# EAGLE design hid_detector (EAGLE 9.6.2)
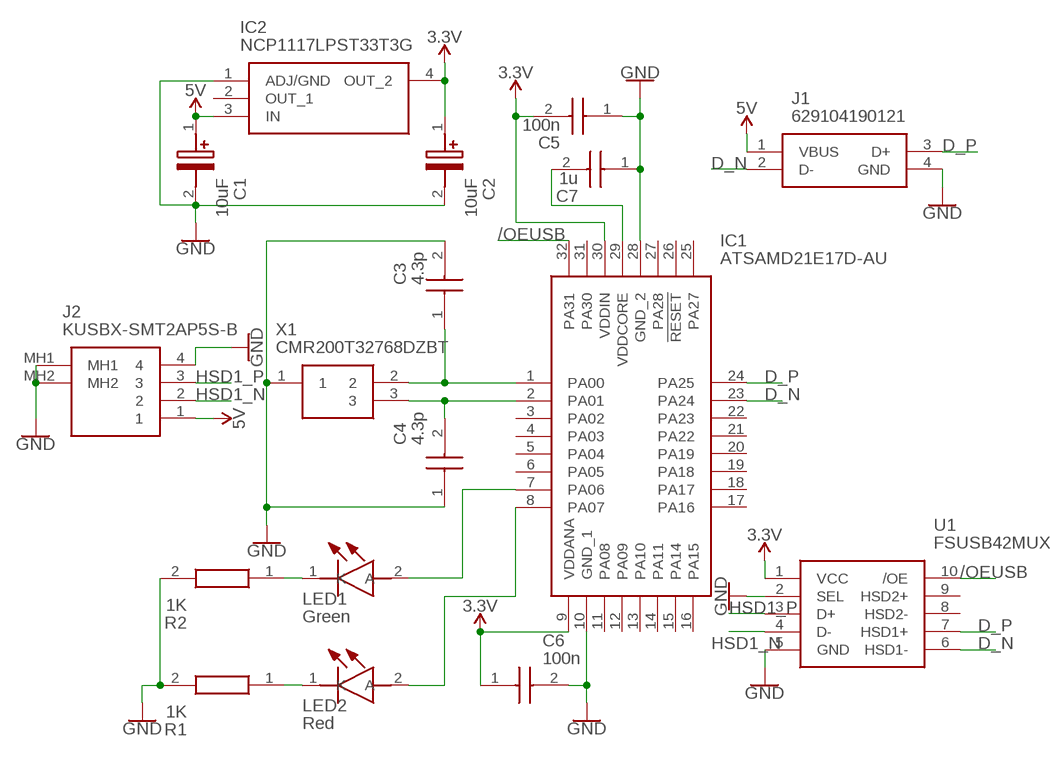
[diagram p0: schematic, sheet 1]

## Parts
C1  10uF  865080440002  [CAPAE400X550N]
C2  10uF  865080440002  [CAPAE400X550N]
C3  4.3p  GRM0335C1E4R3WA01D  [CAPC0603X33N]
C4  4.3p  GRM0335C1E4R3WA01D  [CAPC0603X33N]
C5  100n  EMF105B7104MVHF  [CAPC1005X55N]
C6  100n  EMF105B7104MVHF  [CAPC1005X55N]
C7  1u  EMK105BJ105MVHF  [CAPC1005X55N]
IC1  ATSAMD21E17D-AU  [QFP80P900X900X120-32N]
IC2  NCP1117LPST33T3G  [SOT230P700X180-4N]
J1  629104190121  [629104190121]
J2  KUSBX-SMT2AP5S-B  [KUSBXSMT2AP5SB]
LED1  Green  CMD15-21VGD_TR8  [LEDC3215X130N]
LED2  Red  APT1608EC  [LEDC1608X85N]
R1  1K  RK73H1ETTP1001F  [RESC1005X40N]
R2  1K  RK73H1ETTP1001F  [RESC1005X40N]
U1  FSUSB42MUX  [SOP50P490X110-10N]
X1  CMR200T32768DZBT  [CMR200T]

## Nets
3.3V: C2.1(+) C5.2 C6.1 IC1.9(VDDANA) IC1.30(VDDIN) IC2.4(OUT_2) U1.1(VCC)
5V: C1.1(+) IC2.3(IN) J1.1(VBUS) J2.1
/OEUSB: IC1.32(PA31) U1.10(/OE)
D_N [diff pairs]: IC1.23(PA24) J1.2(D-) U1.6(HSD1-)
D_P [diff pairs]: IC1.24(PA25) J1.3(D+) U1.7(HSD1+)
GND: C1.2(-) C2.2(-) C3.2 C4.1 C5.1 C6.2 C7.1 IC1.10(GND_1) IC1.28(GND_2) IC2.1(ADJ/GND) J1.4(GND) J2.4 J2.MH1 J2.MH2 R1.2 R2.2 U1.2(SEL) U1.5(GND) X1.1
HSD1_N [diff pairs]: J2.2 U1.4(D-)
HSD1_P [diff pairs]: J2.3 U1.3(D+)
N$1: C3.1 IC1.1(PA00) X1.2
N$2: C4.2 IC1.2(PA01) X1.3
N$3: IC1.7(PA06) LED1.2(A)
N$4: LED1.1(K) R2.1
N$5: C7.2 IC1.29(VDDCORE)
N$6: LED2.1(K) R1.1
N$7: IC1.8(PA07) LED2.2(A)
Unconnected: IC1.3(PA02) IC1.4(PA03) IC1.5(PA04) IC1.6(PA05) IC1.11(PA08) IC1.12(PA09) IC1.13(PA10) IC1.14(PA11) IC1.15(PA14) IC1.16(PA15) IC1.17(PA16) IC1.18(PA17) IC1.19(PA18) IC1.20(PA19) IC1.21(PA22) IC1.22(PA23) IC1.25(PA27) IC1.26(!RESET) IC1.27(PA28) IC1.31(PA30) IC2.2(OUT_1) U1.8(HSD2-) U1.9(HSD2+)

## Library data of the parts
C1 C2 = SamacSys_Parts:865080440002: Wurth Elektronik 10uF 25 V dc Aluminium Electrolytic Capacitor, WCAP-ASLI Series 2000h 4 (Dia.) x 5.35mm Source: Datasheet <https://katalog.we-online.com/pbs/datasheet/865080440002.pdf>; DESCRIPTION: Wurth Elektronik 10uF 25 V dc Aluminium Electrolytic Capacitor, WCAP-ASLI Series 2000h 4 (Dia.) x 5.35mm; HEIGHT: 5.5mm; MANUFACTURER_NAME: Wurth Elektronik; MANUFACTURER_PART_NUMBER: 865080440002; MOUSER_PART_NUMBER: 710-865080440002; MOUSER_PRICE-STOCK: https://www.mouser.co.uk/ProductDetail/Wurth-Elektronik/865080440002?qs=0KOYDY2FL2%2FXvxJ7qSnXzw%3D%3D
C3 C4 = SamacSys_Parts:GRM0335C1E4R3WA01D: Chip Capacitor value 4R3 Source: Datasheet <http://www.murata.com/~/media/webrenewal/support/library/catalog/products/capacitor/mlcc/c02e.pdf>; DESCRIPTION: Chip Capacitor value 4R3; HEIGHT: 0.33mm; MANUFACTURER_NAME: Murata Electronics; MANUFACTURER_PART_NUMBER: GRM0335C1E4R3WA01D
C5 C6 = SamacSys_Parts:EMF105B7104MVHF: Multilayer Ceramic Capacitors MLCC - SMD/SMT 0402 16V 0.1uF 20% AEC-Q200 Source: Datasheet <https://componentsearchengine.com/Datasheets/1/EMF105B7104MVHF.pdf>; DESCRIPTION: Multilayer Ceramic Capacitors MLCC - SMD/SMT 0402 16V 0.1uF 20% AEC-Q200; HEIGHT: 0.55mm; MANUFACTURER_NAME: TAIYO YUDEN; MANUFACTURER_PART_NUMBER: EMF105B7104MVHF; MOUSER_PART_NUMBER: 963-EMF105B7104MVHF; MOUSER_PRICE-STOCK: https://www.mouser.co.uk/ProductDetail/Taiyo-Yuden/EMF105B7104MVHF?qs=%252B6g0mu59x7LtSdgNoaFAbQ%3D%3D
C7 = SamacSys_Parts:EMK105BJ105MVHF: TAIYO YUDEN - EMK105BJ105MVHF - CAPACITOR, MLCC, 0402, 16V ,X5R,Q200 02AH5330 Source: Datasheet <https://altium.componentsearchengine.com/Datasheets/2/EMK105BJ105MVHF.pdf>; DESCRIPTION: TAIYO YUDEN - EMK105BJ105MVHF - CAPACITOR, MLCC, 0402, 16V ,X5R,Q200 02AH5330; HEIGHT: 0.55mm; MANUFACTURER_NAME: TAIYO YUDEN; MANUFACTURER_PART_NUMBER: EMK105BJ105MVHF; MOUSER_PART_NUMBER: 963-EMK105BJ105MVHF; MOUSER_PRICE-STOCK: https://www.mouser.co.uk/ProductDetail/Taiyo-Yuden/EMK105BJ105MVHF?qs=sBf%2Fb4nBSle1MydEN1pxPw%3D%3D
IC1 = SamacSys_Parts:ATSAMD21E17D-AU: ARM Microcontrollers - MCU 32TQFP IND TEMP, GREEN,1.6-3.6V,48MHz Source: Datasheet <https://www.arrow.com/en/products/atsamd21e17d-au/microchip-technology>; DESCRIPTION: ARM Microcontrollers - MCU 32TQFP IND TEMP, GREEN,1.6-3.6V,48MHz; HEIGHT: 1.2mm; MANUFACTURER_NAME: Microchip; MANUFACTURER_PART_NUMBER: ATSAMD21E17D-AU; MOUSER_PART_NUMBER: 556-ATSAMD21E17D-AU; MOUSER_PRICE-STOCK: https://www.mouser.co.uk/ProductDetail/Microchip-Technology/ATSAMD21E17D-AU?qs=byeeYqUIh0MuAM%252BW362haw%3D%3D
IC2 = SamacSys_Parts:NCP1117LPST33T3G: Source: Datasheet <http://www.onsemi.com/pub/Collateral/NCP1117LP-D.PDF>; HEIGHT: 1.8mm; MANUFACTURER_NAME: ON Semiconductor; MANUFACTURER_PART_NUMBER: NCP1117LPST33T3G; MOUSER_PART_NUMBER: 863-NCP1117LPST33T3G; MOUSER_PRICE-STOCK: https://www.mouser.co.uk/ProductDetail/ON-Semiconductor/NCP1117LPST33T3G?qs=kbSN2QblFfKG9A4Foh4YYg%3D%3D
J1 = SamacSys_Parts:629104190121: WURTH ELEKTRONIK - 629104190121 - CONN, USB 2 TYPE A, RCPT, 4POS, SMT Source: Datasheet <http://katalog.we-online.de/em/datasheet/629104190121.pdf>; DESCRIPTION: WURTH ELEKTRONIK - 629104190121 - CONN, USB 2 TYPE A, RCPT, 4POS, SMT; HEIGHT: mm; MANUFACTURER_NAME: Wurth Elektronik; MANUFACTURER_PART_NUMBER: 629104190121; MOUSER_PART_NUMBER: 710-629104190121; MOUSER_PRICE-STOCK: https://www.mouser.co.uk/ProductDetail/Wurth-Elektronik/629104190121?qs=lBTPRtX1sU8FkkdswgHZbg%3D%3D
J2 = SamacSys_Parts:KUSBX-SMT2AP5S-B: USB Connectors A TYPE SMT BLK PLUG 1.35mm POSTS SHIELD Source: Datasheet <http://www.kycon.com/Pub_Eng_Draw/KUSBX-SMT2AP5S-X.pdf>; DESCRIPTION: USB Connectors A TYPE SMT BLK PLUG 1.35mm POSTS SHIELD; HEIGHT: 4.75mm; MANUFACTURER_NAME: Kycon; MANUFACTURER_PART_NUMBER: KUSBX-SMT2AP5S-B; MOUSER_PART_NUMBER: 806-KUSBXSMT2AP5SB; MOUSER_PRICE-STOCK: https://www.mouser.co.uk/ProductDetail/Kycon/KUSBX-SMT2AP5S-B?qs=7zcQ9RRVJlhCJlshlB7IBQ%3D%3D
LED1 = SamacSys_Parts:CMD15-21VGD_TR8: VCC CMD15-21VGD/TR8, CMD15-21 Series Clear LED, 570 nm,, Rectangle Lens Source: Datasheet <https://componentsearchengine.com/Datasheets/1/CMD15-21VGD_TR8.pdf>; DESCRIPTION: VCC CMD15-21VGD/TR8, CMD15-21 Series Clear LED, 570 nm,, Rectangle Lens; HEIGHT: 1.3mm; MANUFACTURER_NAME: Visual Communications Company; MANUFACTURER_PART_NUMBER: CMD15-21VGD/TR8; MOUSER_PART_NUMBER: 606-CMD15-21VGD/TR8; MOUSER_PRICE-STOCK: https://www.mouser.com/Search/Refine.aspx?Keyword=606-CMD15-21VGD%2FTR8
LED2 = SamacSys_Parts:APT1608EC: Standard LEDs - SMD HI EFF RED WTR CLR Source: Datasheet; DESCRIPTION: Standard LEDs - SMD HI EFF RED WTR CLR; HEIGHT: 0.85mm; MANUFACTURER_NAME: Kingbright; MANUFACTURER_PART_NUMBER: APT1608EC; MOUSER_PART_NUMBER: 604-APT1608EC; MOUSER_PRICE-STOCK: https://www.mouser.co.uk/ProductDetail/Kingbright/APT1608EC?qs=y3UkhjaxUTbvcINjaB1ATQ%3D%3D
R1 R2 = SamacSys_Parts:RK73H1ETTP1001F: Thick Film Resistors - SMD 1/16watts 1Kohms 1% Source: Datasheet <https://componentsearchengine.com/Datasheets/1/RK73H1ETTP1001F.pdf>; DESCRIPTION: Thick Film Resistors - SMD 1/16watts 1Kohms 1%; HEIGHT: 0.4mm; MANUFACTURER_NAME: KOA Speer; MANUFACTURER_PART_NUMBER: RK73H1ETTP1001F; MOUSER_PART_NUMBER: 660-RK73H1ETTP1001F; MOUSER_PRICE-STOCK: https://www.mouser.com/Search/Refine.aspx?Keyword=660-RK73H1ETTP1001F
U1 = SamacSys_Parts:FSUSB42MUX: ON SEMICONDUCTOR - FSUSB42MUX - USB SWITCH, DUAL, DPDT, MSOP-10 Source: Datasheet <https://componentsearchengine.com/Datasheets/2/FSUSB42MUX.pdf>; DESCRIPTION: ON SEMICONDUCTOR - FSUSB42MUX - USB SWITCH, DUAL, DPDT, MSOP-10; HEIGHT: 1.1mm; MANUFACTURER_NAME: ON Semiconductor; MANUFACTURER_PART_NUMBER: FSUSB42MUX; MOUSER_PART_NUMBER: 512-FSUSB42MUX; MOUSER_PRICE-STOCK: https://www.mouser.co.uk/ProductDetail/ON-Semiconductor-Fairchild/FSUSB42MUX?qs=yA6kp8fx8Y59RAD4iJDRWg%3D%3D
X1 = SamacSys_Parts:CMR200T32768DZBT: Crystals 32.768 KHz 6 pF REFLOWABLE SMD Source: Datasheet <http://cfd.citizen.co.jp/english/prod-tech/product/pdf/datasheet_TF/CMR200T_E.pdf>; DESCRIPTION: Crystals 32.768 KHz 6 pF REFLOWABLE SMD; HEIGHT: mm; MANUFACTURER_NAME: Citizen Finetech Miyota; MANUFACTURER_PART_NUMBER: CMR200T32768DZBT; MOUSER_PART_NUMBER: 695-CMR200T32768DZBT; MOUSER_PRICE-STOCK: https://www.mouser.co.uk/ProductDetail/Citizen-FineDevice/CMR200T32768DZBT?qs=byeeYqUIh0Mb0cbDrw7%2F1Q%3D%3D

## Net classes
1 diff pairs: width 0.254 mm

## Board
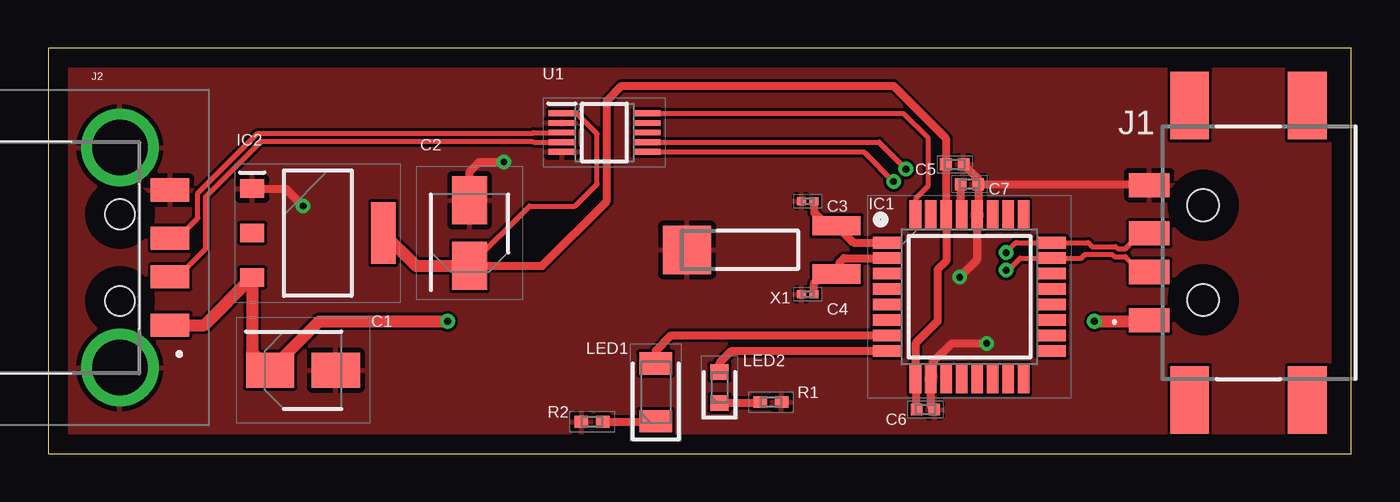
[diagram p1: board, top side]
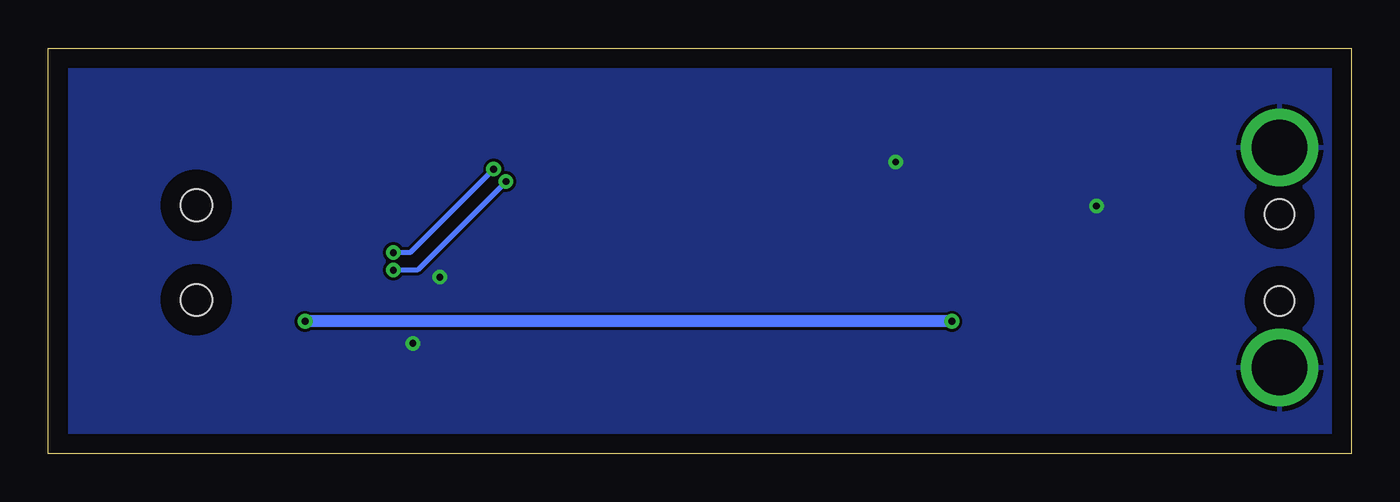
[diagram p2: board, bottom side, seen from below]

Size 67.54 x 21.01 mm. Coordinates in mm from the lower left corner, seen from the top.
Outline: 0,0 67.54,0 67.54,21.01 0,21.01 0,0
Copper layers (1*16): Top 0.035mm / dielectric 1.5mm / Bottom 0.035mm
Design rules "default *": minimum track width 6mil, minimum drill 0.35mm, track to track 6mil, track to pad 6mil, pad to pad 6mil, via to via 6mil, smd to smd 6mil, copper to edge 40mil, drill to drill 6mil, minimum pad ring 10mil, minimum via ring 8mil, stop-mask expansion 4mil, vias tented up to drill 0mil, thermal gap 10mil

### Footprints (pad centres in the part's own frame; a part is rotated, then mirrored left to right if it is on the bottom)
CAPAE400X550N = smd 2.5 x 1.8: 1 -1.7,0; 2 1.7,0
CAPC0603X33N = smd 0.46 x 0.42: 1 -0.33,0; 2 0.33,0
CAPC1005X55N = smd 0.6 x 0.62: 1 -0.46,0; 2 0.46,0
QFP80P900X900X120-32N = smd 1.5 x 0.6: 1 -4.25,2.8; 2 -4.25,2; 3 -4.25,1.2; 4 -4.25,0.4; 5 -4.25,-0.4; 6 -4.25,-1.2; 7 -4.25,-2; 8 -4.25,-2.8; 17 4.25,-2.8; 18 4.25,-2; 19 4.25,-1.2; 20 4.25,-0.4; 21 4.25,0.4; 22 4.25,1.2; 23 4.25,2; 24 4.25,2.8 | smd 0.6 x 1.5: 9 -2.8,-4.25; 10 -2,-4.25; 11 -1.2,-4.25; 12 -0.4,-4.25; 13 0.4,-4.25; 14 1.2,-4.25; 15 2,-4.25; 16 2.8,-4.25; 25 2.8,4.25; 26 2,4.25; 27 1.2,4.25; 28 0.4,4.25; 29 -0.4,4.25; 30 -1.2,4.25; 31 -2,4.25; 32 -2.8,4.25
SOT230P700X180-4N = smd 1.25 x 0.95: 1 -3.4,2.3; 2 -3.4,0; 3 -3.4,-2.3 | smd 1.25 x 3.2: 4 3.4,0
629104190121 = smd 1.25 x 2.1: 1 -3.5,1.1; 2 -1,1.1; 3 1,1.1; 4 3.5,1.1 | smd 3.5 x 2: 5 7.625,-1; 6 7.625,-7.1; 7 -7.625,-7.1; 8 -7.625,-1 | hole 1.65: -2.45,-1.7; 2.45,-1.7
KUSBXSMT2AP5SB = smd 1.2 x 2: 1 3.5,10.125; 2 1,10.125; 3 -1,10.125; 4 -3.5,10.125 | drill 2.89 pad 4: MH1 -5.7,7.525; MH2 5.7,7.525 | hole 1.55: -2.25,7.525; 2.25,7.525
LEDC3215X130N = smd 1.15 x 1.7: 1 -1.5,0; 2 1.5,0
LEDC1608X85N = smd 0.8 x 0.95: 1 -0.8,0; 2 0.8,0
RESC1005X40N = smd 0.7 x 0.6: 1 -0.55,0; 2 0.55,0
SOP50P490X110-10N = smd 1.4 x 0.3: 1 -2.2,1; 2 -2.2,0.5; 3 -2.2,0; 4 -2.2,-0.5; 5 -2.2,-1; 6 2.2,-1; 7 2.2,-0.5; 8 2.2,0; 9 2.2,0.5; 10 2.2,1
CMR200T = smd 2.5 x 2.5: 1 -5.75,-1 | smd 2.5 x 1: 2 2,0.25; 3 2,-2.25

### Placement (x,y rotation side)
C1  13.21,4.32 0 top
C2  21.84,11.43 90 top
C3  39.37,13.08 180 top
C4  39.37,8.26 0 top
C5  46.99,14.99 180 top
C6  45.47,2.29 0 top
C7  47.75,13.97 180 top
IC1  47.75,8.13 0 top
IC2  13.97,11.43 0 top
J1  58.17,10.41 90 top
J2  -3.81,10.16 270 top
LED1  31.5,3.17 90 top
LED2  34.8,3.43 90 top
R1  37.47,2.67 0 top
R2  28.19,1.65 180 top
U1  28.83,16.64 0 top
X1  38.86,11.56 0 top

### Tracks (layer width: path | path; a pad name or v marks a point on that pad's centre or on a via)
3.3V
  Top 0.254: C2.1 24.94,12.83 27.3,12.83 28.45,13.97 28.45,16.56 27.37,17.64 U1.1
  Top 0.406: C6.1 45.01,3.82 IC1.9 | IC1.9 | C2.1 25.61,9.73 28.96,13.08 28.96,18.29 29.72,19.05 43.81,19.05 46.53,16.34 C5.2 46.53,12.4 IC1.30 46.55,9.98 46.1,9.53 46.1,6.86 44.96,5.71 IC1.9
  Top 0.61: IC2.4 19.07,9.73 C2.1
5V  (via drill 0.35)
  Top 0.61: J2.1 8.1,6.66 IC2.3 10.57,5.26 C1.1 14.05,6.86 v20.7,6.86 | v54.23,6.86 57.01,6.86 J1.1
  Bottom 0.61: v20.7,6.86 v54.23,6.86
/OEUSB
  Top 0.254: U1.10 44.34,17.64 45.59,16.38 45.59,13.84 44.95,13.2 IC1.32
D_N  (via drill 0.35)
  Top 0.254: J1.2 56.64,9.41 55.84,10.21 55.27,10.21 55.16,10.32 53.76,10.32 53.56,10.13 IC1.23 50.39,10.13 49.76,9.51 v49.66,9.51 | v43.81,14.1 42.27,15.64 U1.6
  Bottom 0.254: v43.81,14.1 48.41,9.51 v49.66,9.51
D_P  (via drill 0.35)
  Top 0.254: J1.3 56.64,11.41 55.84,10.62 55.44,10.62 55.33,10.73 54.11,10.73 53.91,10.93 IC1.24 50.17,10.93 v49.66,10.41 | v44.46,14.74 43.06,16.14 U1.7
  Bottom 0.254: v44.46,14.74 48.78,10.41 v49.66,10.41
GND  (via drill 0.35)
  Top 0.406: C7.1 48.21,12.44 IC1.28 48.13,12.36 48.13,10.03 v47.24,9.14 | C5.1 48.21,14.22 C7.1 | C6.2 45.75,2.46 IC1.10 45.9,4.02 45.9,4.78 46.84,5.71 v48.64,5.71 | IC2.1 12.3,13.73 v13.21,12.83 | C2.2 21.84,14.61 22.35,15.11 v23.62,15.11 | C7.1 57.01,13.97 J1.4
  pour Top: 1.4,0.38 66.8,0.38 66.8,20.57 0.51,20.57 0.51,0.38
  pour Bottom: 0.51,0.38 66.55,0.38 66.55,20.57 0.51,20.57
HSD1_N
  Top 0.254: U1.4 25.14,16.14 25.1,16.18 11.03,16.18 8.16,13.31 8.16,10.6 6.71,9.16 J2.2
HSD1_P
  Top 0.254: U1.3 25.15,16.64 25.11,16.59 10.86,16.59 7.75,13.48 7.75,12.2 6.71,11.16 J2.3
N$1
  Top 0.406: C3.1 39.7,12.5 40.39,11.81 X1.2 41.74,10.93 IC1.1
N$2
  Top 0.406: C4.2 39.7,8.84 40.17,9.31 X1.3 41.02,9.47 41.02,9.91 41.24,10.13 IC1.2
N$3
  Top 0.406: LED1.2 31.5,5.33 32.29,6.13 IC1.7
N$4
  Top 0.406: R2.1 31.47,1.65 LED1.1
N$5
  Top 0.406: C7.2 47.29,12.44 IC1.29
N$6
  Top 0.406: LED2.1 36.88,2.63 R1.1
N$7
  Top 0.406: LED2.2 34.8,4.7 35.43,5.33 IC1.8